# Altium schematic sheet Sheet_1_2023-02-04.schdoc
size 140 x 76 mm
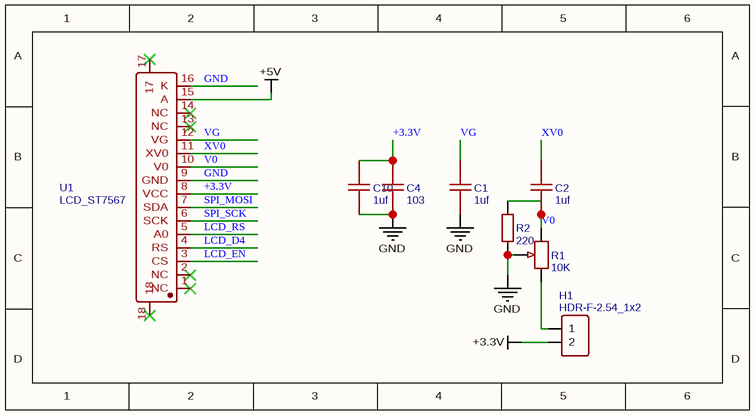
[diagram p0: Sheet_1_2023-02-04.schdoc]

## Parts
C1  1uf  [C0805]
C2  1uf  [C0805]
C4  103  [C0805]
C10  1uf  [C0805]
H1  HDR-F-2.54_1x2  [HDR-F-2.54_1X2]
R1  10K  [RES-ADJ-TH_RM063-103]
R2  220  [R0805]
U1  LCD_ST7567  [LCD_ST7567]

## Nets
+3.3V: C4.2 C10.2 H1.2 U1.8(VCC)
+5V: U1.15(A)
GND: C1.1 C4.1 C10.1 R1.2 R2.2 U1.9(GND) U1.16(K)
LCD_D4: U1.4(RS)
LCD_EN: U1.3(CS)
LCD_RS: U1.5(A0)
SPI_MOSI: U1.7(SDA)
SPI_SCK: U1.6(SCK)
V0: C2.1 R1.3 R2.1 U1.10(V0)
VG: C1.2 U1.12(VG)
XV0: C2.2 U1.11(XV0)
NetH1_1: H1.1 R1.1

Not connected (* = marked no-connect by the designer): U1 1(NC)* 2(NC)* 13(NC)* 14(NC)* 17* 18*

## Library data of the parts
C1 C2 C10 = 1uf: BOM_Manufacturer: SAMSUNG(三星); BOM_Manufacturer Part: CL21A226MQQNNNE; nameAlias: Capacitance; BOM_Supplier: LCSC; BOM_Supplier Part: C5674; BOM_JLCPCB Part Class: Extended Part; spicePre: C; spiceSymbolName: CL21A226MQQNNNE
C4 = 103: BOM_Manufacturer: SAMSUNG(三星); BOM_Manufacturer Part: CL21A226MQQNNNE; nameAlias: Capacitance; BOM_Supplier: LCSC; BOM_Supplier Part: C5674; BOM_JLCPCB Part Class: Extended Part; spicePre: C; spiceSymbolName: CL21A226MQQNNNE
H1 = HDR-F-2.54_1x2: Contributor: Oleg19685; BOM_Supplier Part: C49661; BOM_Supplier: LCSC; spicePre: H; spiceSymbolName: HDR-F-2.54_1x2
R1 = 10K: BOM_Manufacturer: JML; BOM_Manufacturer Part: RM063-103 10K; nameAlias: Resistance(Ohms); BOM_Supplier: LCSC; BOM_Supplier Part: C38793; spicePre: R; spiceSymbolName: RM063-103 10K
R2 = 220: BOM_Manufacturer: UNI-ROYAL(厚声); BOM_Manufacturer Part: 0805W8F1002T5E; nameAlias: Resistance; Resistance (Ohms): 10K; BOM_Supplier: LCSC; BOM_Supplier Part: C17414; BOM_JLCPCB Part Class: Basic Part; spicePre: R; spiceSymbolName: 0805W8F1002T5E
U1 = LCD_ST7567: Contributor: tung3108vn; spicePre: U; spiceSymbolName: LCD_ST7567